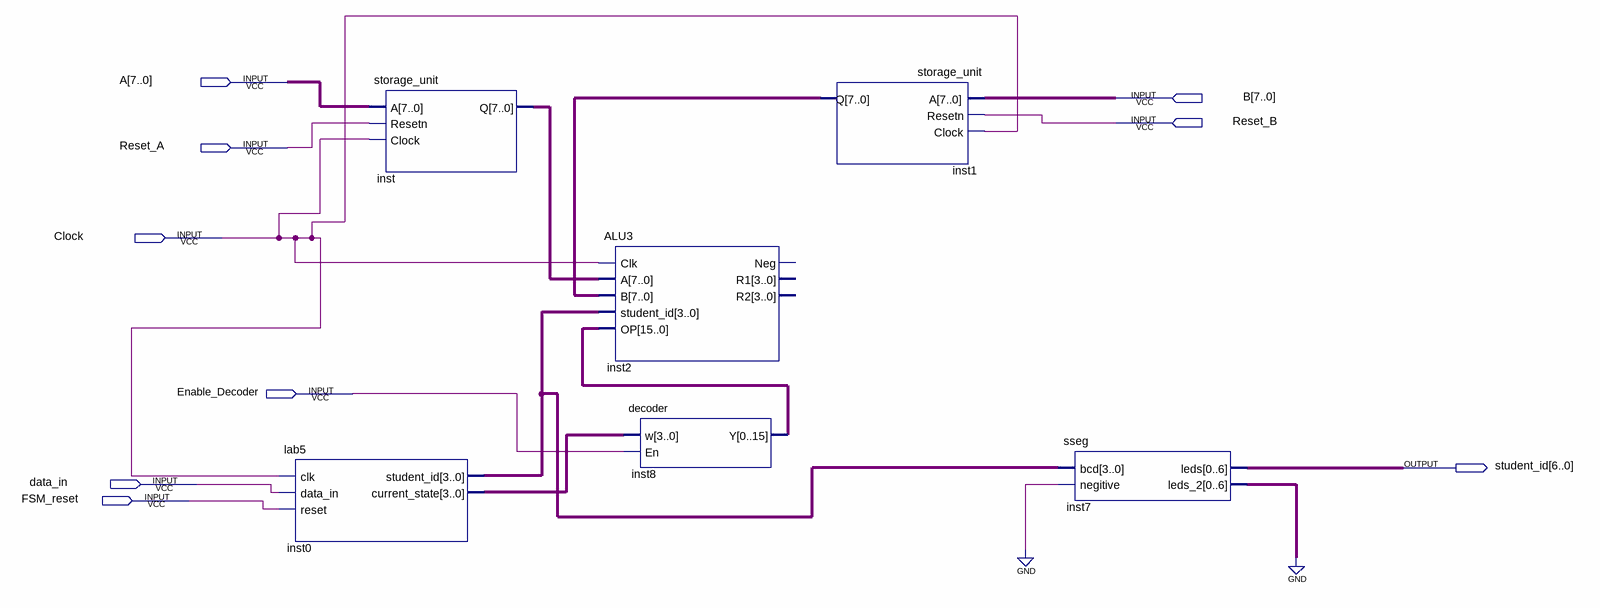
[diagram p0: schematic sheet]
// Quartus schematic probset3.bdf as structural Verilog: 6 symbols, 9 pins
module probset3 (
  input  [7:0] A,
  input  [7:0] B,
  input  Reset_B,
  input  Reset_A,
  input  Clock,
  input  Enable_Decoder,
  input  data_in,
  input  FSM_reset,
  output [6:0] student_id
);

  wire [3:0] inst0_current_state, inst0_student_id;
  wire [6:0] inst7_leds_2;
  wire [7:0] inst1_q, inst_q;
  wire [15:0] inst8_y;

  lab5 inst0 (
    .clk(Clock), .data_in(data_in), .reset(FSM_reset), .student_id(inst0_student_id),
    .current_state(inst0_current_state));
  storage_unit inst (.A(A), .Resetn(Reset_A), .Clock(Clock), .Q(inst_q));
  ALU3 inst2 (.Clk(Clock), .A(inst_q), .B(inst1_q), .student_id(inst0_student_id), .OP(inst8_y));  // open: Neg, R1, R2
  decoder inst8 (.w(inst0_current_state), .En(Enable_Decoder), .Y(inst8_y));
  storage_unit inst1 (.A(B), .Resetn(Reset_B), .Clock(Clock), .Q(inst1_q));
  sseg inst7 (.bcd(inst0_student_id), .negitive(1'b0), .leds(student_id), .leds_2(inst7_leds_2));
  // also tied to GND on the sheet: {inst7_leds_2[0], inst7_leds_2[1], inst7_leds_2[2], inst7_leds_2[3], inst7_leds_2[4], inst7_leds_2[5], inst7_leds_2[6]}
endmodule
